# Altium schematic sheet MicroMultimeter_EXP_Sch.SchDoc: MicroMultimeter - EXP
size 127 x 101 mm; Author: Hom; CompanyName: KitSprout; DrawnBy: Hom; Engineer: Hom; Organization: KitSprout; Revision: A; SheetNumber: 1; SheetTotal: 1; License: CC BY-SA 4.0; Version: 1.0; LibVersion: 1.4; PageSetup: Record=PageOptions|CenterHorizontal=True|CenterVertical=True|PrintScale=1.00|XCorrection=1.00|YCorrection=1.00|PrintKind=0|BorderSize=5000000|LeftOffset=0|BottomOffset=0|Orientation=2|PaperLength=1000|PaperWidth=1000|Scale=100|PaperSource=7|PrintQuality=-3|MediaType=1|DitherType=10|PrintScaleMode=0|PaperKind=A4|PaperIndex=9
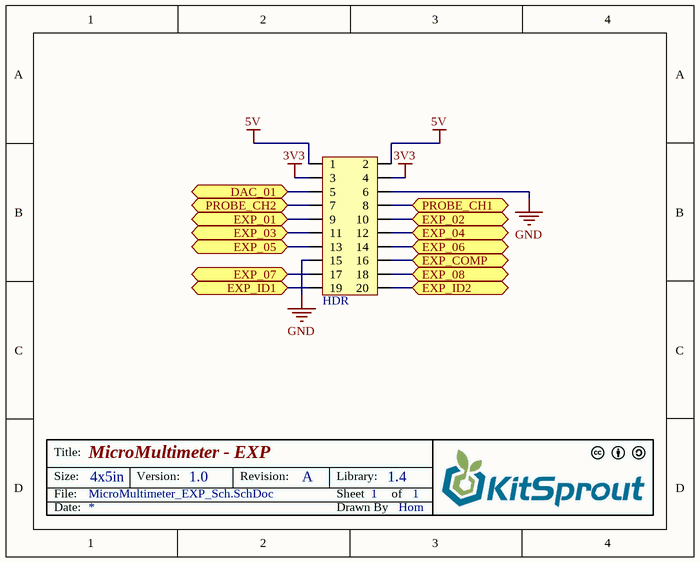
[diagram p0: MicroMultimeter_EXP_Sch.SchDoc]

## Parts
HDR  HDR2x10_2.54  [HDR2X10_2.54_180HF]  (value not drawn)

## Ports
DAC_01, EXP_01, EXP_02, EXP_03, EXP_04, EXP_05, EXP_06, EXP_07, EXP_08, EXP_COMP, EXP_ID1, EXP_ID2, PROBE_CH1, PROBE_CH2

## Nets
3V3: HDR.3 HDR.4
5V: HDR.1 HDR.2
GND: HDR.6 HDR.15
DAC_01: HDR.5 ; port DAC_01
EXP_01: HDR.9 ; port EXP_01
EXP_02: HDR.10 ; port EXP_02
EXP_03: HDR.11 ; port EXP_03
EXP_04: HDR.12 ; port EXP_04
EXP_05: HDR.13 ; port EXP_05
EXP_06: HDR.14 ; port EXP_06
EXP_07: HDR.17 ; port EXP_07
EXP_08: HDR.18 ; port EXP_08
EXP_COMP: HDR.16 ; port EXP_COMP
EXP_ID1: HDR.19 ; port EXP_ID1
EXP_ID2: HDR.20 ; port EXP_ID2
PROBE_CH1: HDR.8 ; port PROBE_CH1
PROBE_CH2: HDR.7 ; port PROBE_CH2

## Notes on the sheet
- Title:
- Size:
- Date:
- File:
- 4x5in
- Version:
- Revision:
- Sheet
- Drawn By
- Library:
- of

## Library data of the parts
HDR = HDR2x10_2.54: Header